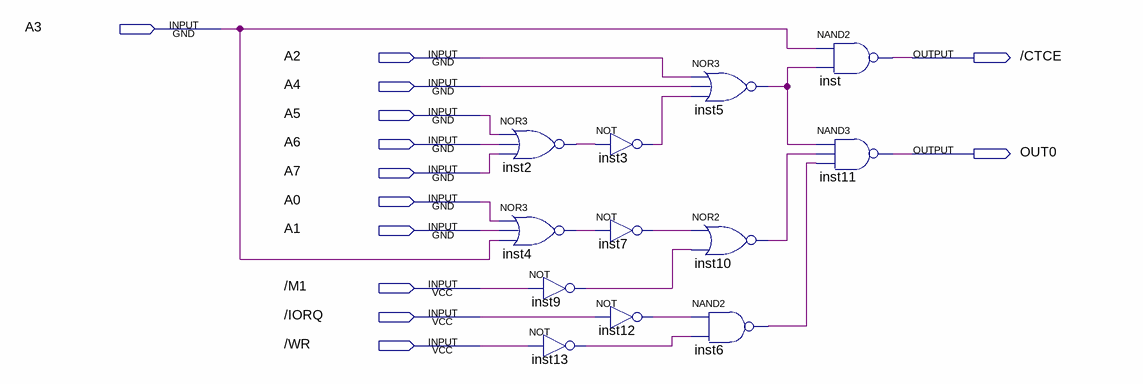
[diagram p0: schematic sheet]
// Quartus schematic CPLD_1.bdf as structural Verilog: 12 symbols, 13 pins
module CPLD_1 (
  input  A3,
  input  A2,
  input  A4,
  input  A5,
  input  A6,
  input  A7,
  input  A0,
  input  A1,
  input  \/M1 ,
  input  \/IORQ ,
  input  \/WR ,
  output \/CTCE ,
  output OUT0
);

  wire inst2_out, inst3_out, inst4_out, inst5_out, inst6_out, inst7_out, inst9_out, inst10_out, inst12_out,
       inst13_out;

  nor inst2 (inst2_out, A5, A6, A7);
  nor inst4 (inst4_out, A0, A1, A3);
  not inst9 (inst9_out, \/M1 );
  not inst13 (inst13_out, \/WR );
  not inst3 (inst3_out, inst2_out);
  not inst7 (inst7_out, inst4_out);
  not inst12 (inst12_out, \/IORQ );
  nor inst5 (inst5_out, A2, A4, inst3_out);
  nor inst10 (inst10_out, inst7_out, inst9_out);
  nand inst6 (inst6_out, inst12_out, inst13_out);
  nand inst (\/CTCE , A3, inst5_out);
  nand inst11 (OUT0, inst5_out, inst10_out, inst6_out);
endmodule
